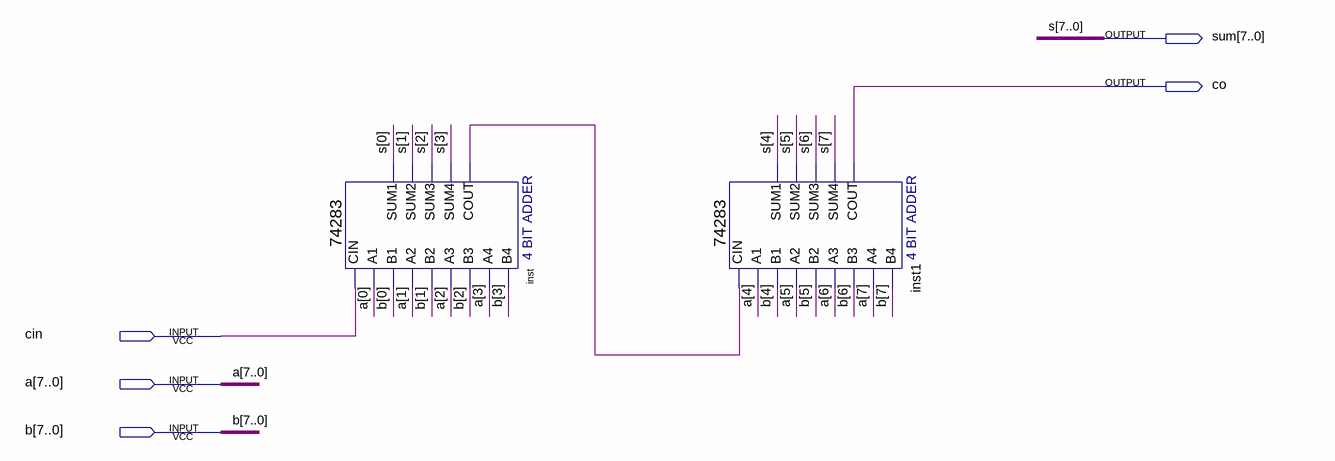
[diagram p0: schematic sheet]
// Quartus schematic adder8.bdf as structural Verilog: 2 symbols, 5 pins
module adder8 (
  input  cin,
  input  [7:0] a,
  input  [7:0] b,
  output [7:0] sum,
  output co
);

  wire inst_cout;

  \74283  inst (
    .CIN(cin), .A1(a[0]), .A2(a[1]), .B2(b[1]), .A3(a[2]), .A4(a[3]), .B4(b[3]), .B1(b[0]), .B3(b[2]),
    .SUM4(sum[3]), .COUT(inst_cout), .SUM1(sum[0]), .SUM2(sum[1]), .SUM3(sum[2]));
  \74283  inst1 (
    .CIN(inst_cout), .A1(a[4]), .A2(a[5]), .B2(b[5]), .A3(a[6]), .A4(a[7]), .B4(b[7]), .B1(b[4]), .B3(b[6]),
    .SUM4(sum[7]), .COUT(co), .SUM1(sum[4]), .SUM2(sum[5]), .SUM3(sum[6]));

  // Other names for the same wires on the sheet: s[7:0] = sum
endmodule
